# EAGLE board PlatineUntenV2 (EAGLE 9.3.0), part 1 of 2
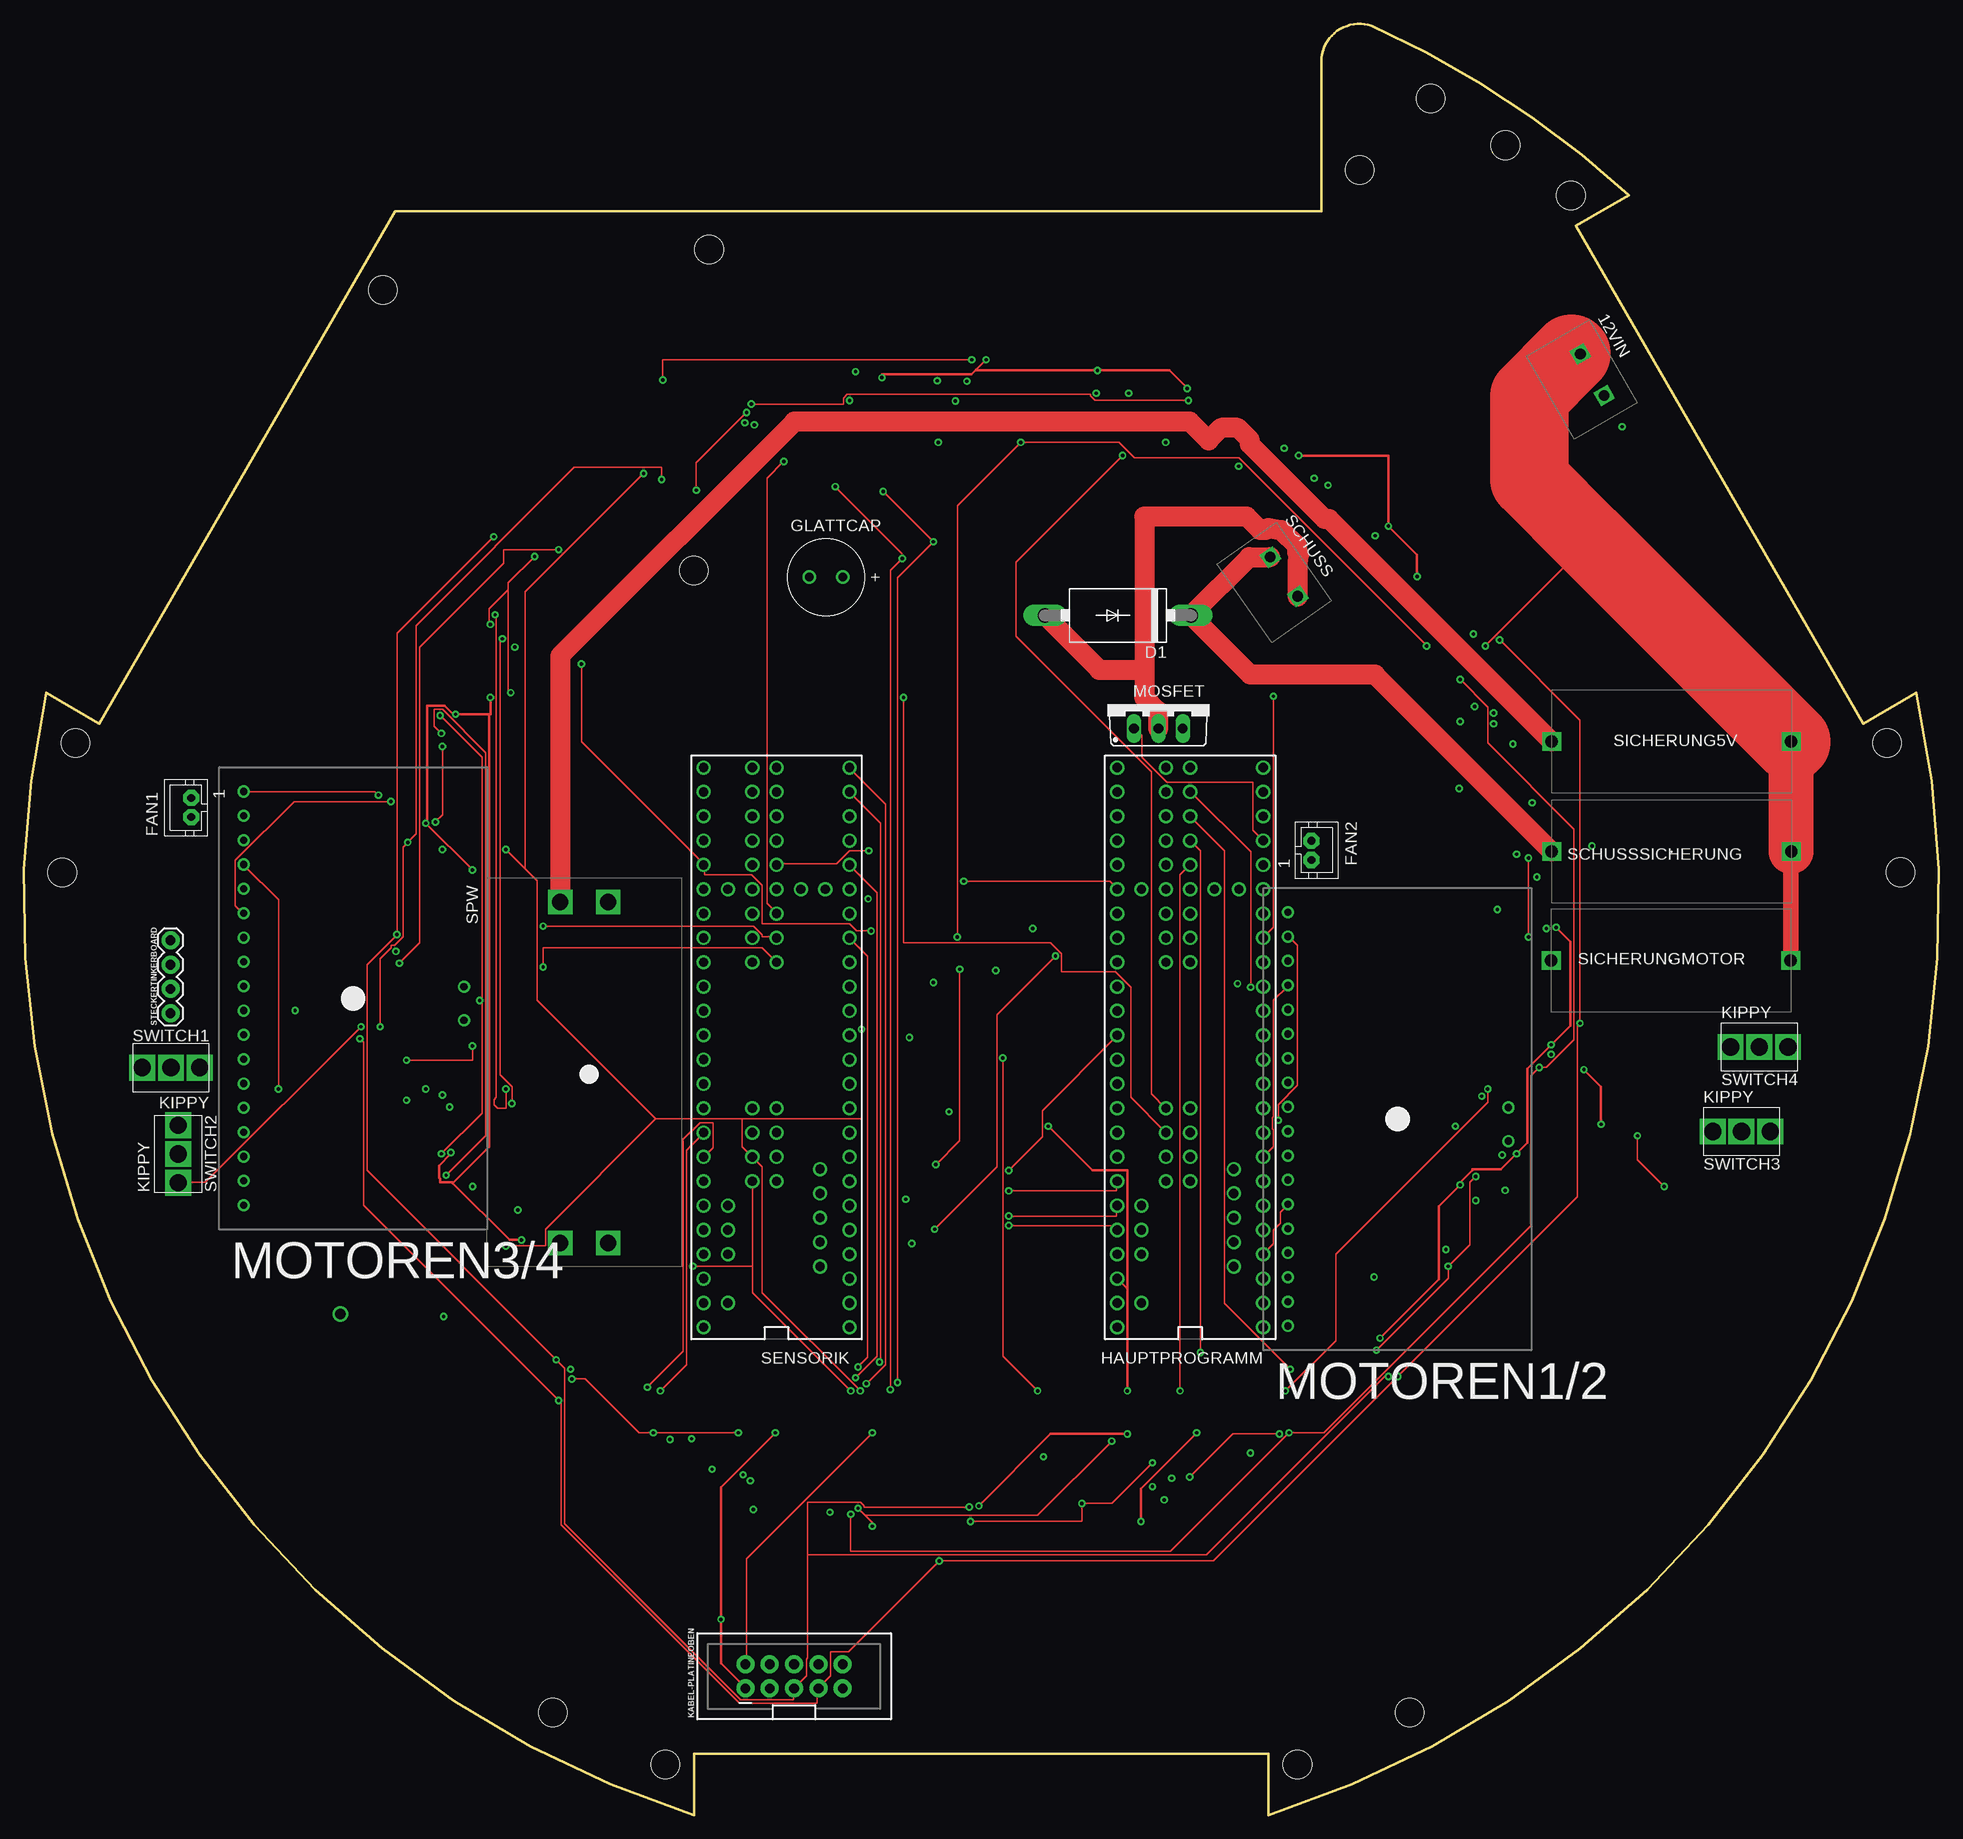
[diagram p7: board, top side]
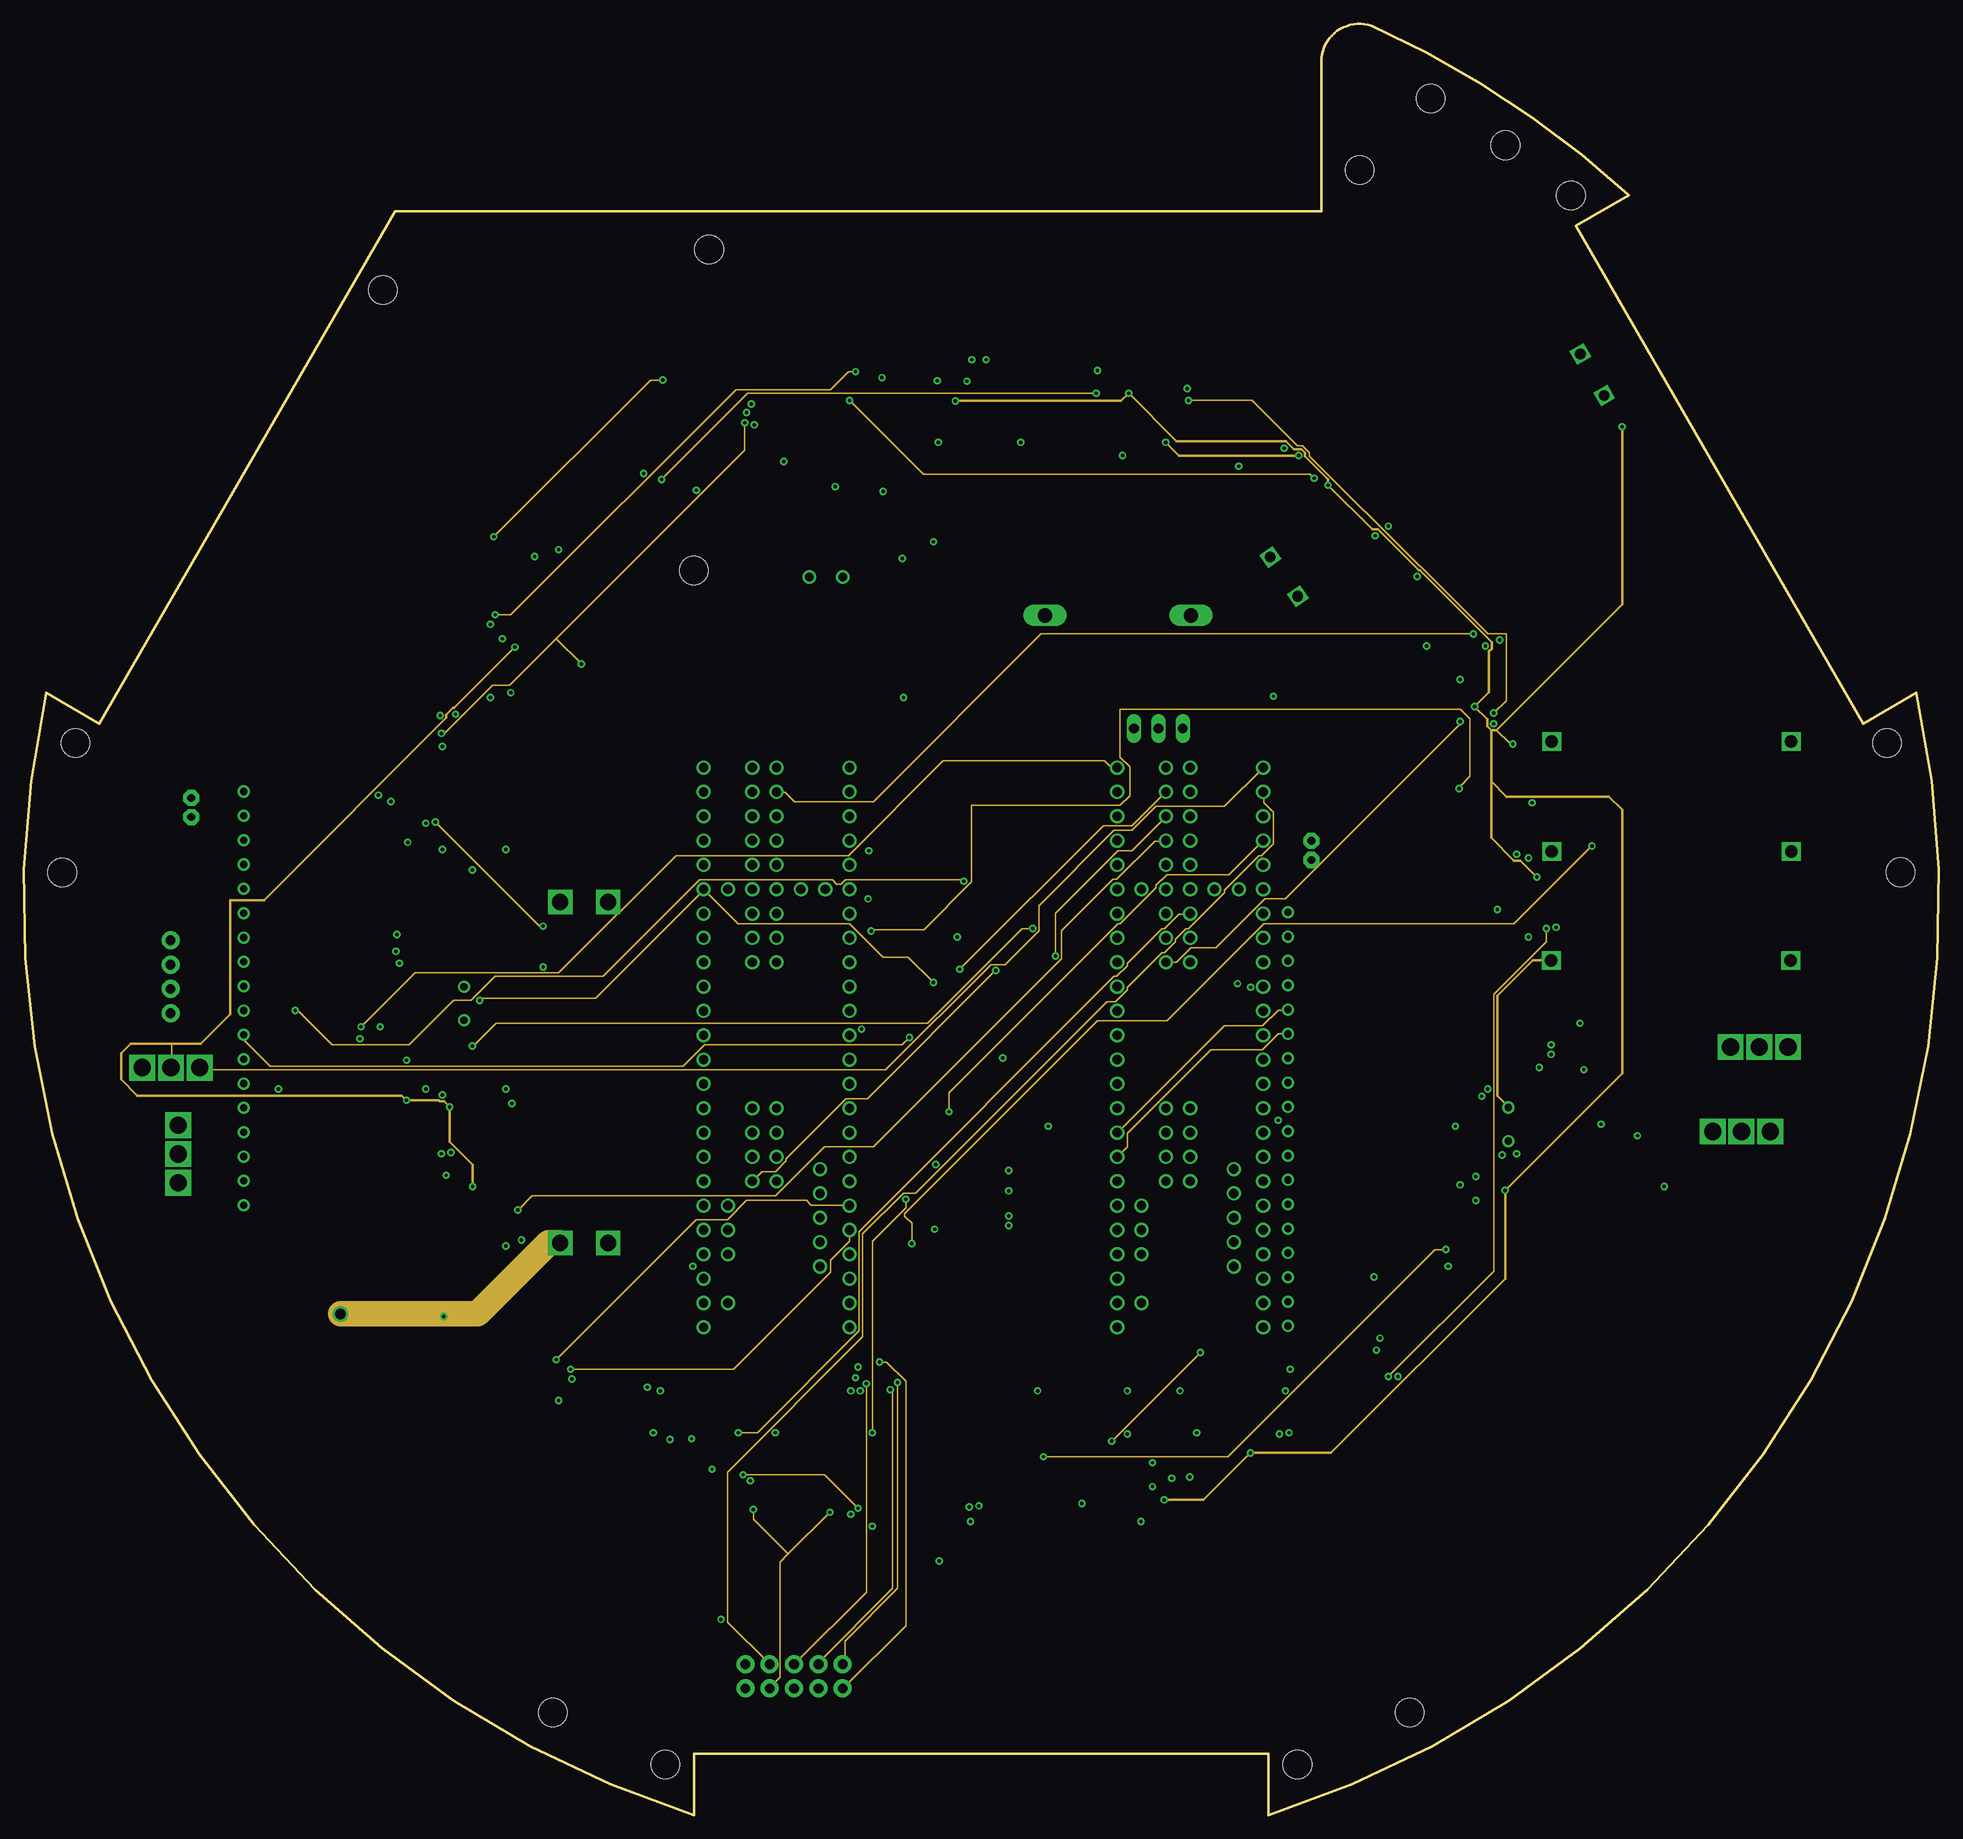
[diagram p8: board, inner layer Route2]
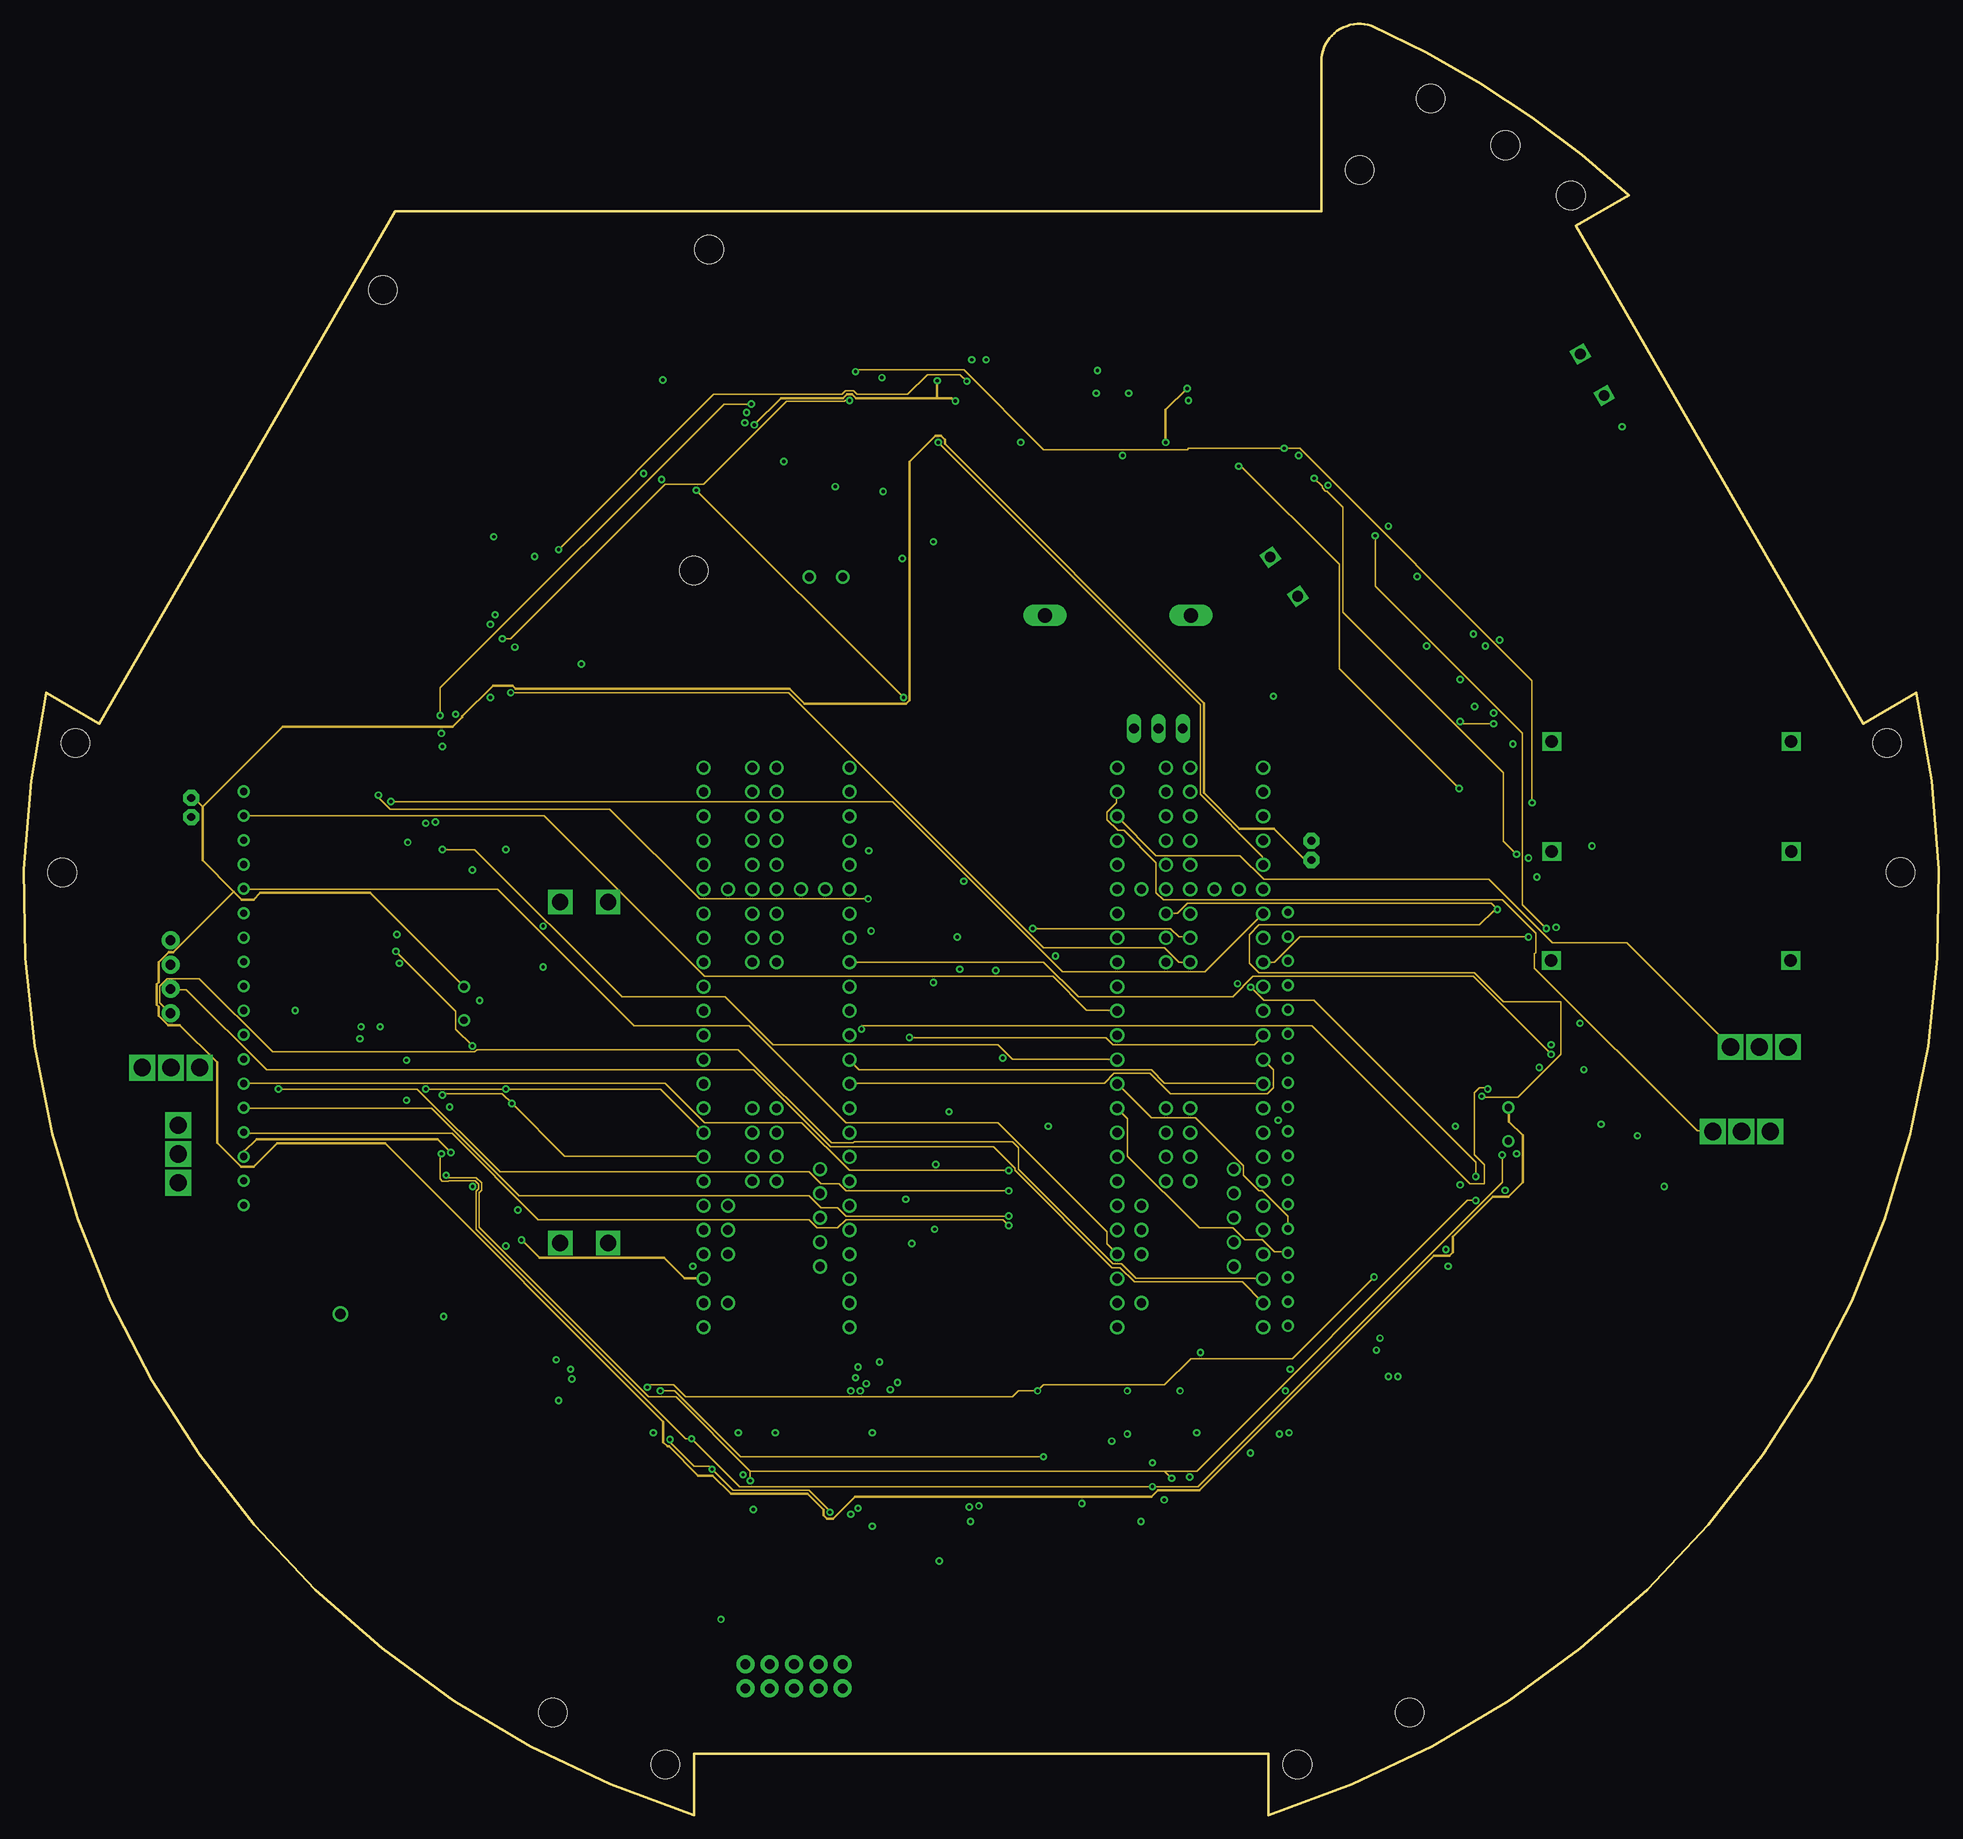
[diagram p9: board, inner layer Route15]
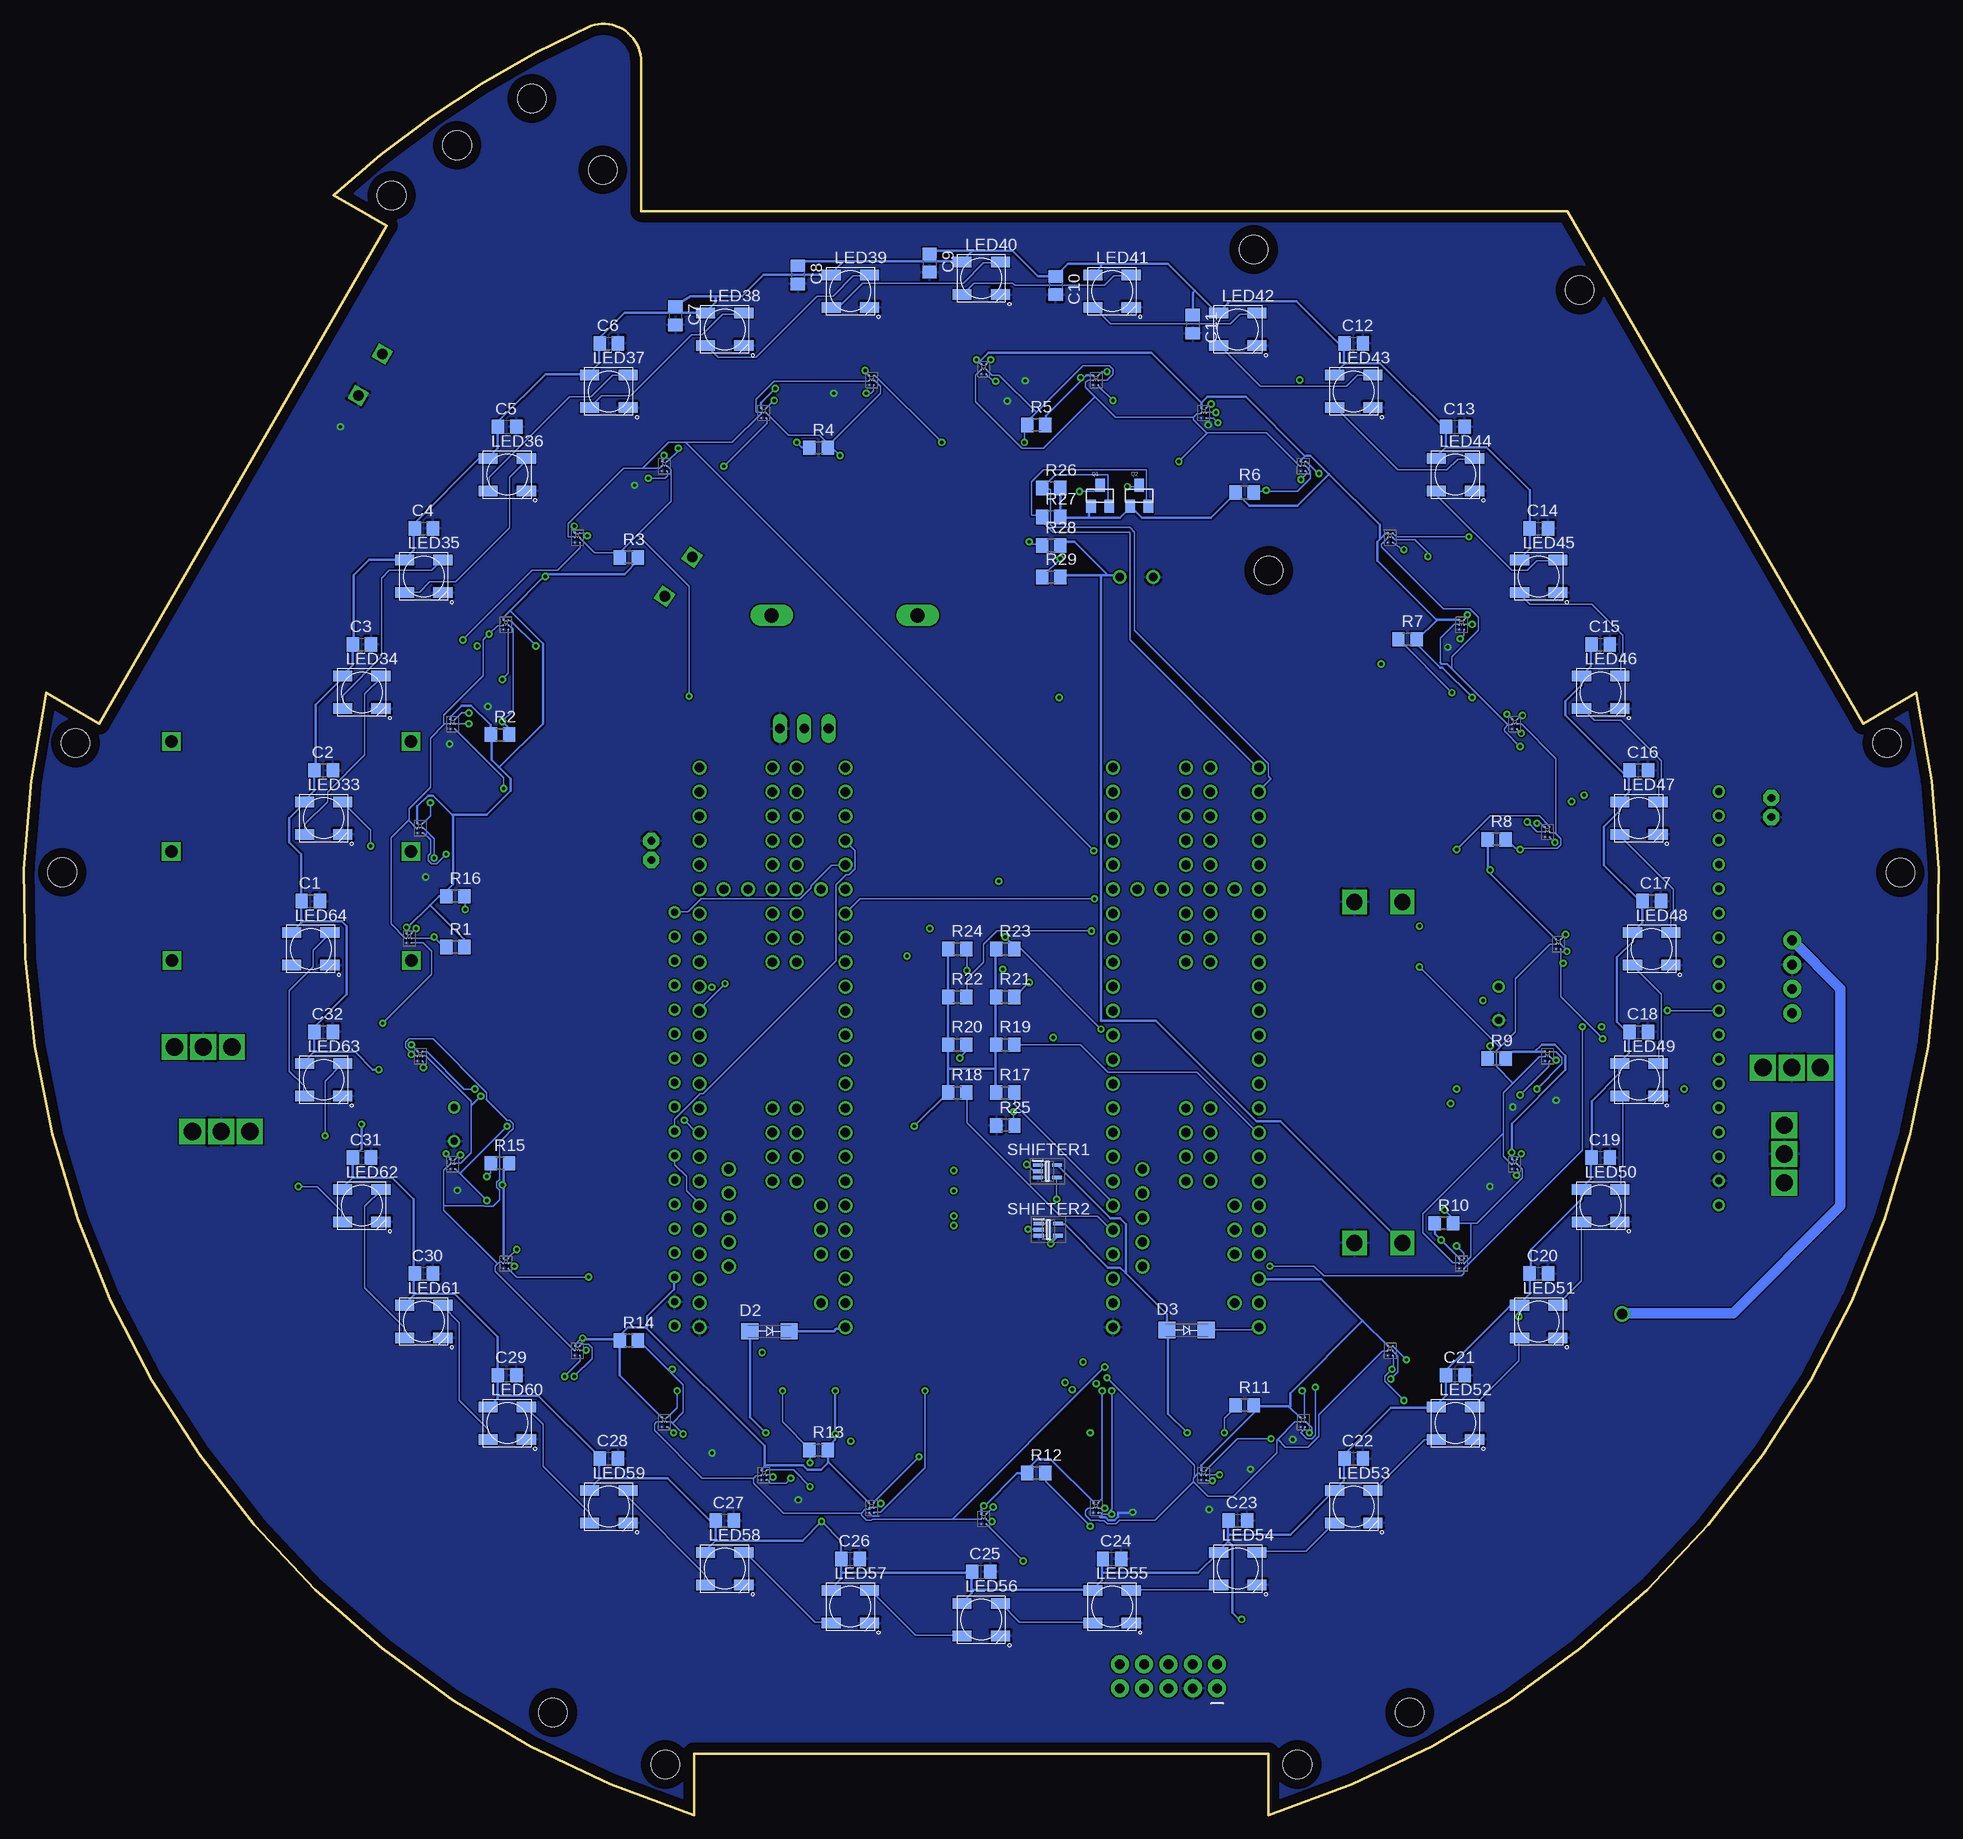
[diagram p10: board, bottom side, seen from below]

Size 199.89 x 186.94 mm. Coordinates in mm from the lower left corner, seen from the top.
Outline: 140.67,186.73 arc109 135.45,183 135.45,167.39 38.75,167.39 7.87,113.91 2.33,117.11 arc85 69.95,0 69.95,6.39 129.95,6.39 129.95,0 arc85 197.56,117.11 192.02,113.91 162.02,165.88 167.56,169.07 arc19 140.67,186.73
Copper layers (1+2*15+16): Top 0.07mm / dielectric 1.5mm / Route2 0.07mm / dielectric 0.15mm / Route15 0.07mm / dielectric 0.2mm / Bottom 0.07mm
Design rules "default *": minimum track width 6mil, minimum drill 0.35mm, track to track 6mil, track to pad 6mil, pad to pad 6mil, via to via 6mil, smd to smd 6mil, copper to edge 40mil, drill to drill 6mil, minimum pad ring 10mil, minimum via ring 8mil, stop-mask expansion 4mil, vias tented up to drill 1.1mm, thermal gap 10mil
Net classes: 1 int0.1A: width 0.1 mm, drill 0.1 mm, clearance 0.1 mm to class 0, clearance 0.1 mm; 2 int0.4A: width 0.1 mm, drill 0.1 mm, clearance 0.1 mm to class 0, clearance 0.1 mm to class 1, clearance 0.1 mm; 3 int1A: width 0.25 mm, drill 0.25 mm, clearance 0.1 mm to class 0, clearance 0.1 mm to class 1, clearance 0.1 mm to class 2, clearance 0.1 mm; 4 ext1A: width 0.1 mm, drill 0.1 mm, clearance 0.1 mm to class 0, clearance 0.1 mm to class 1, clearance 0.1 mm to class 2, clearance 0.1 mm to class 3, clearance 0.1 mm; 5 ext2A: width 0.25 mm, drill 0.25 mm, clearance 0.1 mm to class 0, clearance 0.1 mm to class 1, clearance 0.1 mm to class 2, clearance 0.1 mm to class 3, clearance 0.1 mm to class 4, clearance 0.1 mm; 6 ext3A: width 0.4 mm, drill 0.4 mm, clearance 0.2 mm to class 0, clearance 0.2 mm to class 1, clearance 0.2 mm to class 2, clearance 0.2 mm to class 3, clearance 0.2 mm to class 4, clearance 0.2 mm to class 5, clearance 0.2 mm; 7 ext4A: width 0.6 mm, drill 0.6 mm, clearance 0.3 mm to class 0, clearance 0.3 mm to class 1, clearance 0.3 mm to class 2, clearance 0.3 mm to class 3, clearance 0.3 mm to class 4, clearance 0.3 mm to class 5, clearance 0.3 mm to class 6, clearance 0.3 mm; 8 ext5A: width 0.8 mm, drill 0.8 mm, clearance 0.4 mm to class 0, clearance 0.4 mm to class 1, clearance 0.4 mm to class 2, clearance 0.4 mm to class 3, clearance 0.4 mm to class 4, clearance 0.4 mm to class 5, clearance 0.4 mm to class 6, clearance 0.4 mm to class 7, clearance 0.4 mm; 9 ext6A: width 1.1 mm, drill 1.1 mm, clearance 0.6 mm to class 0, clearance 0.6 mm to class 1, clearance 0.6 mm to class 2, clearance 0.6 mm to class 3, clearance 0.6 mm to class 4, clearance 0.6 mm to class 5, clearance 0.6 mm to class 6, clearance 0.6 mm to class 7, clearance 0.6 mm to class 8, clearance 0.6 mm; 10 ext7A: width 1.3 mm, drill 1.3 mm, clearance 0.7 mm to class 0, clearance 0.7 mm to class 1, clearance 0.7 mm to class 2, clearance 0.7 mm to class 3, clearance 0.7 mm to class 4, clearance 0.7 mm to class 5, clearance 0.7 mm to class 6, clearance 0.7 mm to class 7, clearance 0.7 mm to class 8, clearance 0.7 mm to class 9, clearance 0.7 mm; 11 ext8A: width 1.6 mm, drill 1.6 mm, clearance 0.7 mm to class 0, clearance 0.7 mm to class 1, clearance 0.7 mm to class 2, clearance 0.7 mm to class 3, clearance 0.7 mm to class 4, clearance 0.7 mm to class 5, clearance 0.7 mm to class 6, clearance 0.7 mm to class 7, clearance 0.7 mm to class 8, clearance 0.7 mm to class 9, clearance 0.7 mm to class 10, clearance 0.7 mm; 12 ext9A: width 1.8 mm, drill 1.8 mm, clearance 0.7 mm to class 0, clearance 0.7 mm to class 1, clearance 0.7 mm to class 2, clearance 0.7 mm to class 3, clearance 0.7 mm to class 4, clearance 0.7 mm to class 5, clearance 0.7 mm to class 6, clearance 0.7 mm to class 7, clearance 0.7 mm to class 8, clearance 0.7 mm to class 9, clearance 0.7 mm to class 10, clearance 0.7 mm to class 11, clearance 0.7 mm; 13 ext10A: width 2.1 mm, drill 2.1 mm, clearance 0.7 mm to class 0, clearance 0.7 mm to class 1, clearance 0.7 mm to class 2, clearance 0.7 mm to class 3, clearance 0.7 mm to class 4, clearance 0.7 mm to class 5, clearance 0.7 mm to class 6, clearance 0.7 mm to class 7, clearance 0.7 mm to class 8, clearance 0.7 mm to class 9, clearance 0.7 mm to class 10, clearance 0.7 mm to class 11, clearance 0.7 mm to class 12, clearance 0.7 mm; 14 ext25A: width 7.3 mm, drill 7.3 mm, clearance 1 mm to class 0, clearance 1 mm to class 1, clearance 1 mm to class 2, clearance 1 mm to class 3, clearance 1 mm to class 4, clearance 1 mm to class 5, clearance 1 mm to class 6, clearance 1 mm to class 7, clearance 1 mm to class 8, clearance 1 mm to class 9, clearance 1 mm to class 10, clearance 1 mm to class 11, clearance 1 mm to class 12, clearance 1 mm to class 13, clearance 1 mm
Holes 3 mm at 139.45,171.71 69.95,129.89 132.95,5.26 37.47,159.18 154.67,174.27 5.39,111.88 144.66,10.71 161.5,169.04 71.52,163.39 194.5,111.88 55.23,10.71 195.9,98.39 66.95,5.26 3.99,98.38 146.85,179.15

## Footprints (pad centres in the part's own frame; a part is rotated, then mirrored left to right if it is on the bottom)
TERMINAL = drill 1.1 square: GND 0,0; V+ -5,0
TSL2584TSV = smd 0.213 x 0.213: ADDR 0,0.5; GND 0,0; INT 0.5,0.5; SCL 0.5,0; SDA 0.5,1; VDD 0,1
C0805 = smd 1.3 x 1.5: 1 -0.95,0; 2 0.95,0
DO201-15 = drill 1.499 long: A 7.62,0; C -7.62,0
SMA-DO214AC = smd 1.8 x 1.7: A -2.05,0; K 2.05,0
JST-PH2 = drill 0.813 pad 1.676 octagon: 1 1,0; 2 -1,0
GLATTCAP = drill 0.9: 1 1.75,0; 2 -1.75,0
TEENSY3.6_FULL = drill 0.965: 0 -8.89,29.21; 1 -8.89,26.67; 2 -8.89,24.13; 3 -8.89,21.59; 3.3V_2 -3.81,-13.97; 3V3_1 -8.89,-3.81; 3V3_3 1.27,-26.67; 3V3_MAX_250 6.35,26.67; 4 -8.89,19.05; 5 -8.89,16.51; 6 -8.89,13.97; 7 -8.89,11.43; 8 -8.89,8.89; 9 -8.89,6.35; 10 -8.89,3.81; 11 -8.89,1.27; 12 -8.89,-1.27; 13 6.35,-1.27; 14 6.35,1.27; 15 6.35,3.81; 16 6.35,6.35; 17 6.35,8.89; 18 6.35,11.43; 19 6.35,13.97; 20 6.35,16.51; 21 6.35,19.05; 22 6.35,21.59; 23 6.35,24.13; 24 -8.89,-6.35; 25 -8.89,-8.89; 26 -8.89,-11.43; 27 -8.89,-13.97; 28 -8.89,-16.51; 29 -8.89,-19.05; 30 -8.89,-21.59; 31 -8.89,-24.13; 32 -8.89,-26.67; 33 6.35,-26.67; 34 6.35,-24.13; 35 6.35,-21.59; 36 6.35,-19.05; 37 6.35,-16.51; 38 6.35,-13.97; 39 6.35,-11.43; 40 -1.27,-6.35; 41 -1.27,-8.89; 42 -1.27,-11.43; 43 -1.27,-16.51; 44 -1.27,-19.05; 45 -1.27,-21.59; 46 -1.27,-24.13; 47 1.27,-24.13; 48 1.27,-21.59; 49 1.27,-19.05; 50 1.27,-16.51; 51 1.27,-11.43; 52 1.27,-8.89; 53 1.27,-6.35; 54 1.27,8.89; 55 1.27,11.43; 56 1.27,13.97; 57 1.27,16.51; +5V -5.817,25.4; A10 3.81,21.59; A11 3.81,19.05; A21 6.35,-8.89; A22 6.35,-6.35; AGND 6.35,29.21; AREF 3.81,24.13; D+ -5.817,20.32; D- -5.817,22.86; DC -1.27,11.43; DD -1.27,8.89; DE -1.27,13.97; GND1 -8.89,31.75; GND2 6.35,-3.81; GND3 -5.817,17.78; GND4 -5.817,15.24; GND5 -1.27,-13.97; GND6 -1.27,16.51; GND7 -1.27,-26.67; PROGRAM 1.27,-13.97; RESET 3.81,-13.97; VBAT -6.35,-13.97; VIN 6.35,31.75; VUSB 3.81,29.21
2X5-SHROUDED(3D) = drill 1.016 pad 1.88: 1 -1.27,5.08; 2 1.27,5.08; 3 -1.27,2.54; 4 1.27,2.54; 5 -1.27,0; 6 1.27,0; 7 -1.27,-2.54; 8 1.27,-2.54; 9 -1.27,-5.08; 10 1.27,-5.08
WS2812B = smd 2 x 1.1: DIN 2,1.7; DOUT -2,-1.7; VDD -2,1.7; VSS 2,-1.7
TO220BV = drill 1.016 long: D 0,-2.54; G -2.54,-2.54; S 2.54,-2.54
MOTORTREIBER = drill 0.75: EN 0,22.86; GND 23,19.3; GND(5V) 0,2.54; INV 0,27.94; M1FB 0,20.32; M1IN1 0,10.16; M1IN2 0,7.62; M1PWM1 0,15.24; M1PWM2 0,12.7; M1SF 0,17.78; M2FB 0,43.18; M2IN1 0,33.02; M2IN2 0,30.48; M2PWM1 0,38.1; M2PWM2 0,35.56; M2SF 0,40.64; SLEW 0,25.4; VDD(5V) 0,5.08; VIN 23,22.8; VIN2 0,0
SOT23 = smd 1 x 1.4: 1 -0.95,-1.1; 2 0.95,-1.1; 3 0,1.1
R0805 = smd 1.3 x 1.5: 1 -0.95,0; 2 0.95,0
SICHERUNGSHALTER = drill 1.3 square: PIN1 -12.5,0; PIN2 12.5,0
SOT65P212X110-5N = smd 1.05 x 0.4: 1 -1,0.65; 2 -1,0; 3 -1,-0.65; 4 1,-0.65; 5 1,0.65
POLOLU5V9A = drill 1.7 square: GND 0,5; GNDOUT 35.6,5; VIN 0,0; VOUT 35.6,0
1X04 = drill 1.016 pad 1.88: 1 0,0; 2 2.54,0; 3 5.08,0; 4 7.62,0
KIPPY = drill 1.8 pad 2.5 square: VIN 3,0; VOUT1 0,0; VOUT2 6,0

## Placement (x,y rotation side)
12VIN  TERMINAL  [TERMINAL]  164.99,148.17 300 top
B1  TSL2584TSV  [TSL2584TSV]  159.95,90.99 0 bottom
B2  TSL2584TSV  [TSL2584TSV]  158.79,102.5 0 bottom
B3  TSL2584TSV  [TSL2584TSV]  155.38,113.36 0 bottom
B4  TSL2584TSV  [TSL2584TSV]  149.83,123.73 0 bottom
B5  TSL2584TSV  [TSL2584TSV]  142.37,132.82 0 bottom
B6  TSL2584TSV  [TSL2584TSV]  133.28,140.28 0 bottom
B7  TSL2584TSV  [TSL2584TSV]  122.91,145.83 0 bottom
B8  TSL2584TSV  [TSL2584TSV]  111.65,149.24 0 bottom
B9  TSL2584TSV  [TSL2584TSV]  99.95,150.39 0 bottom
B10  TSL2584TSV  [TSL2584TSV]  88.24,149.24 0 bottom
B11  TSL2584TSV  [TSL2584TSV]  76.98,145.83 0 bottom
B12  TSL2584TSV  [TSL2584TSV]  66.61,140.28 0 bottom
B13  TSL2584TSV  [TSL2584TSV]  57.52,132.82 0 bottom
B14  TSL2584TSV  [TSL2584TSV]  50.06,123.73 0 bottom
B15  TSL2584TSV  [TSL2584TSV]  44.51,113.36 0 bottom
B16  TSL2584TSV  [TSL2584TSV]  41.1,102.1 0 bottom
B17  TSL2584TSV  [TSL2584TSV]  39.95,90.39 0 bottom
B18  TSL2584TSV  [TSL2584TSV]  41.1,78.69 0 bottom
B19  TSL2584TSV  [TSL2584TSV]  44.51,67.43 0 bottom
B20  TSL2584TSV  [TSL2584TSV]  50.06,57.06 0 bottom
B21  TSL2584TSV  [TSL2584TSV]  57.52,47.97 0 bottom
B22  TSL2584TSV  [TSL2584TSV]  66.61,40.51 0 bottom
B23  TSL2584TSV  [TSL2584TSV]  76.98,34.96 0 bottom
B24  TSL2584TSV  [TSL2584TSV]  88.24,31.55 0 bottom
B25  TSL2584TSV  [TSL2584TSV]  99.95,30.39 0 bottom
B26  TSL2584TSV  [TSL2584TSV]  111.65,31.55 0 bottom
B27  TSL2584TSV  [TSL2584TSV]  122.91,34.96 0 bottom
B28  TSL2584TSV  [TSL2584TSV]  133.28,40.51 0 bottom
B29  TSL2584TSV  [TSL2584TSV]  142.37,47.97 0 bottom
B30  TSL2584TSV  [TSL2584TSV]  149.83,57.06 0 bottom
B31  TSL2584TSV  [TSL2584TSV]  155.38,67.43 0 bottom
B32  TSL2584TSV  [TSL2584TSV]  158.79,78.69 0 bottom
C1  0.1uF  [C0805]  169.95,95.39 0 bottom
C2  0.1uF  [C0805]  168.6,109.05 0 bottom
C3  0.1uF  [C0805]  164.62,122.18 0 bottom
C4  0.1uF  [C0805]  158.15,134.28 0 bottom
C5  0.1uF  [C0805]  149.44,144.89 0 bottom
C6  0.1uF  [C0805]  138.84,153.6 0 bottom
C7  0.1uF  [C0805]  131.87,156.48 270 bottom
C8  0.1uF  [C0805]  119.09,160.75 270 bottom
C9  0.1uF  [C0805]  105.35,161.99 270 bottom
C10  0.1uF  [C0805]  92.19,159.64 270 bottom
C11  0.1uF  [C0805]  77.87,155.61 270 bottom
C12  0.1uF  [C0805]  61.06,153.6 0 bottom
C13  0.1uF  [C0805]  50.45,144.89 0 bottom
C14  0.1uF  [C0805]  41.74,134.28 0 bottom
C15  0.1uF  [C0805]  35.27,122.18 0 bottom
C16  0.1uF  [C0805]  31.29,109.05 0 bottom
C17  0.1uF  [C0805]  29.95,95.39 0 bottom
C18  0.1uF  [C0805]  31.29,81.74 0 bottom
C19  0.1uF  [C0805]  35.27,68.61 0 bottom
C20  0.1uF  [C0805]  41.74,56.5 0 bottom
C21  0.1uF  [C0805]  50.45,45.9 0 bottom
C22  0.1uF  [C0805]  61.06,37.19 0 bottom
C23  0.1uF  [C0805]  73.16,30.72 0 bottom
C24  0.1uF  [C0805]  86.29,26.74 0 bottom
C25  0.1uF  [C0805]  99.95,25.39 0 bottom
C26  0.1uF  [C0805]  113.6,26.74 0 bottom
C27  0.1uF  [C0805]  126.73,30.72 0 bottom
C28  0.1uF  [C0805]  138.84,37.19 0 bottom
C29  0.1uF  [C0805]  149.44,45.9 0 bottom
C30  0.1uF  [C0805]  158.15,56.5 0 bottom
C31  0.1uF  [C0805]  164.62,68.61 0 bottom
C32  0.1uF  [C0805]  168.6,81.74 0 bottom
D1  1N5404  [DO201-15]  114.22,125.2 180 top
D2  GF1  [SMA-DO214AC]  122.05,50.48 0 bottom
D3  GF1  [SMA-DO214AC]  78.51,50.61 0 bottom
FAN1  [JST-PH2]  17.48,105.15 90 top
FAN2  [JST-PH2]  134.4,100.68 270 top
GLATTCAP  1000uF/6.3V  [GLATTCAP]  83.75,129.19 0 top
HAUPTPROGRAMM  TEENSY3.6_FULL  [TEENSY3.6_FULL]  120.49,82.65 180 top
KABEL-PLATINEOBEN  2x5shrouded  [2X5-SHROUDED(3D)]  80.4,14.47 90 top
LED33  WS2812B  [WS2812B]  168.6,104.05 0 bottom
LED34  WS2812B  [WS2812B]  164.62,117.18 0 bottom
LED35  WS2812B  [WS2812B]  158.15,129.28 0 bottom
LED36  WS2812B  [WS2812B]  149.44,139.89 0 bottom
LED37  WS2812B  [WS2812B]  138.84,148.6 0 bottom
LED38  WS2812B  [WS2812B]  126.73,155.07 0 bottom
LED39  WS2812B  [WS2812B]  113.6,159.05 0 bottom
LED40  WS2812B  [WS2812B]  99.95,160.39 0 bottom
LED41  WS2812B  [WS2812B]  86.29,159.05 0 bottom
LED42  WS2812B  [WS2812B]  73.16,155.07 0 bottom
LED43  WS2812B  [WS2812B]  61.06,148.6 0 bottom
LED44  WS2812B  [WS2812B]  50.45,139.89 0 bottom
LED45  WS2812B  [WS2812B]  41.74,129.28 0 bottom
LED46  WS2812B  [WS2812B]  35.27,117.18 0 bottom
LED47  WS2812B  [WS2812B]  31.29,104.05 0 bottom
LED48  WS2812B  [WS2812B]  29.95,90.39 0 bottom
LED49  WS2812B  [WS2812B]  31.29,76.74 0 bottom
LED50  WS2812B  [WS2812B]  35.27,63.61 0 bottom
LED51  WS2812B  [WS2812B]  41.74,51.5 0 bottom
LED52  WS2812B  [WS2812B]  50.45,40.9 0 bottom
LED53  WS2812B  [WS2812B]  61.06,32.19 0 bottom
LED54  WS2812B  [WS2812B]  73.16,25.72 0 bottom
LED55  WS2812B  [WS2812B]  86.29,21.74 0 bottom
LED56  WS2812B  [WS2812B]  99.95,20.39 0 bottom
LED57  WS2812B  [WS2812B]  113.6,21.74 0 bottom
LED58  WS2812B  [WS2812B]  126.73,25.72 0 bottom
LED59  WS2812B  [WS2812B]  138.84,32.19 0 bottom
LED60  WS2812B  [WS2812B]  149.44,40.9 0 bottom
LED61  WS2812B  [WS2812B]  158.15,51.5 0 bottom
LED62  WS2812B  [WS2812B]  164.62,63.61 0 bottom
LED63  WS2812B  [WS2812B]  168.6,76.74 0 bottom
LED64  WS2812B  [WS2812B]  169.95,90.39 0 bottom
MOSFET  IRF540  [TO220BV]  118.43,115.94 0 top
MOTOREN1/2  MOTORTREIBER  [MOTORTREIBER]  131.97,51.04 0 top
MOTOREN3/4  MOTORTREIBER  [MOTORTREIBER]  22.94,63.64 0 top
Q1  MOSFET-NCHANNELBSS138  [SOT23]  87.55,137.69 0 bottom
Q2  MOSFET-NCHANNELBSS138  [SOT23]  83.45,137.69 0 bottom
R1  10k  [R0805]  154.85,90.59 0 bottom
R2  10k  [R0805]  150.19,112.77 0 bottom
R3  10k  [R0805]  136.75,131.27 0 bottom
R4  10k  [R0805]  116.94,142.7 0 bottom
R5  10k  [R0805]  94.2,145.09 0 bottom
R6  10k  [R0805]  72.45,138.03 0 bottom
R7  10k  [R0805]  55.45,122.72 0 bottom
R8  10k  [R0805]  46.15,101.83 0 bottom
R9  10k  [R0805]  46.15,78.96 0 bottom
R10  10k  [R0805]  51.65,61.77 0 bottom
R11  10k  [R0805]  72.45,42.76 0 bottom
R12  10k  [R0805]  94.2,35.7 0 bottom
R13  10k  [R0805]  116.94,38.09 0 bottom
R14  10k  [R0805]  136.75,49.52 0 bottom
R15  10k  [R0805]  150.19,68.02 0 bottom
R16  10k  [R0805]  154.85,95.89 0 bottom
R17  4.7k  [R0805]  97.45,75.39 0 bottom
R18  4.7k  [R0805]  102.45,75.39 0 bottom
R19  4.7k  [R0805]  97.45,80.39 0 bottom
R20  4.7k  [R0805]  102.45,80.39 0 bottom
R21  4.7k  [R0805]  97.45,85.39 0 bottom
R22  4.7k  [R0805]  102.45,85.39 0 bottom
R23  4.7k  [R0805]  97.45,90.39 0 bottom
R24  4.7k  [R0805]  102.45,90.39 0 bottom
R25  10k  [R0805]  97.43,71.98 0 bottom
R26  10k  [R0805]  92.65,138.49 0 bottom
R27  10k  [R0805]  92.65,135.49 0 bottom
R28  10k  [R0805]  92.65,132.49 0 bottom
R29  10k  [R0805]  92.65,129.19 0 bottom
SCHUSS  TERMINAL  [TERMINAL]  132.99,127.2 305 top
SCHUSSSICHERUNG  SICHERUNGSHALTER  [SICHERUNGSHALTER]  172.01,100.56 180 top
SENSORIK  TEENSY3.6_FULL  [TEENSY3.6_FULL]  77.31,82.65 180 top
SHIFTER1  74HC1G125GW,125  [SOT65P212X110-5N]  93.05,67.19 0 bottom
SHIFTER2  74HC1G125GW,125  [SOT65P212X110-5N]  92.95,61.09 0 bottom
SICHERUNG5V  SICHERUNGSHALTER  [SICHERUNGSHALTER]  172,112.04 0 top
SICHERUNGMOTOR  SICHERUNGSHALTER  [SICHERUNGSHALTER]  171.95,89.17 0 top
SPW  POLOLU5V9A  [POLOLU5V9A]  55.99,95.3 270 top
STECKERTINKERBOARD  4-Pin-Header  [1X04]  15.3,83.68 90 top
SWITCH1  KIPPY  [KIPPY]  18.34,78.01 180 top
SWITCH2  KIPPY  [KIPPY]  16.11,65.99 90 top
SWITCH3  KIPPY  [KIPPY]  176.31,71.34 0 top
SWITCH4  KIPPY  [KIPPY]  178.17,80.16 0 top